# Altium schematic sheet 03-PSU-ps2-blueretro.SchDoc
size A; SheetNumber: 4; SheetTotal: 4
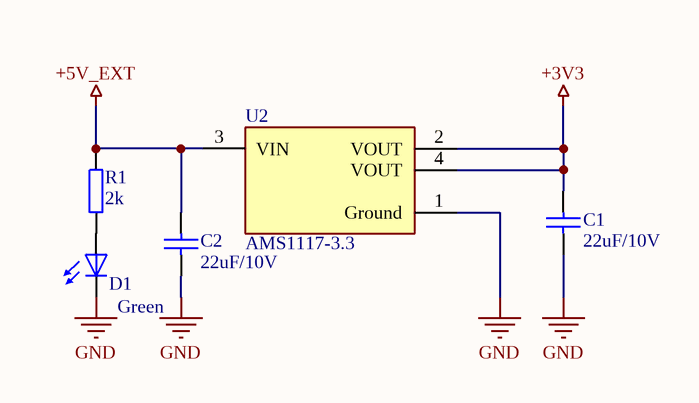
[diagram p0: 03-PSU-ps2-blueretro.SchDoc]

## Parts
C1  value 22uF/10V  [cap_0603]  (hidden comment: cap_0603)
C2  value 22uF/10V  [cap_0603]  (hidden comment: cap_0603)
D1  value Green  [led0603_GREEN]  (hidden comment: led_0603)
R1  value 2k  [res_0603]  (hidden comment: res_0603)
U2  AMS1117-3.3  [FP-AMS1117-IPC_C]

## Nets
+3V3: C1.2 U2.2(VOUT) U2.4(VOUT)
+5V_EXT: C2.2 R1.2 U2.3(VIN)
GND: C1.1 C2.1 D1.2(C) U2.1(Ground)
NetD1_1: D1.1(A) R1.1

## Library data of the parts
D1 = led_0603: Green 3,2V 20mA; Manufacturer: Würth Elektronik; Manufacturer Part Number: 150060GS75000; Supplier: Digikey; Price: 0,14; Supplier Part Number: 732-4971-1-ND; ComponentLink1Description: Supplier Link; ComponentLink1URL: https://www.digikey.at/de/products/detail/w%C3%BCrth-elektronik/150060GS75000/4489898; ComponentLink2Description: Manufacturer Link; ComponentLink2URL: *; ComponentLink3Description: Datasheet Link; ComponentLink3URL: https://www.we-online.com/components/products/datasheet/150060GS75000.pdf
U2 = CMP-209535-000001-1: LDO Voltage Regulators 1A, 3.3V; Manufacturer: Advanced Monolithic Systems; Dropout Voltage: 1.1V; Output Type: Fixed; Nominal Supply Current: 5mA; Max Power Dissipation: 1.2W; Max Supply Voltage: 15V; Number Of Outputs: 1; Standoff Height: 0.64mm; Max Junction Temp: +125°C; Height: 1.8mm; Package: AMS1117; Device Class L2: Power Management ICs; ComponentLink2Description: Datasheet; ComponentLink2URL: http://www.advanced-monolithic.com/pdf/ds1117.pdf; Category: IC; RoHS: TRUE; Automotive: No; Device Class L1: Integrated Circuits (ICs); Output Current: 1A; Device Class L3: Voltage Regulators - Linear; Temperature: -40°C to +125°C; Output Voltage: 3.3V; Manufacturer Part Number: AMS1117-3.3; Temperature Range Low: -40°C; Octopart: https://octopart.com/ams1117-3.3-advanced+monolithic+systems-25899300; Lead Free: Yes; Ipc Land Pattern Name: SOT229P700X180-4; Temperature Range High: +125°C